# Altium schematic sheet DAC.SchDoc
size A4
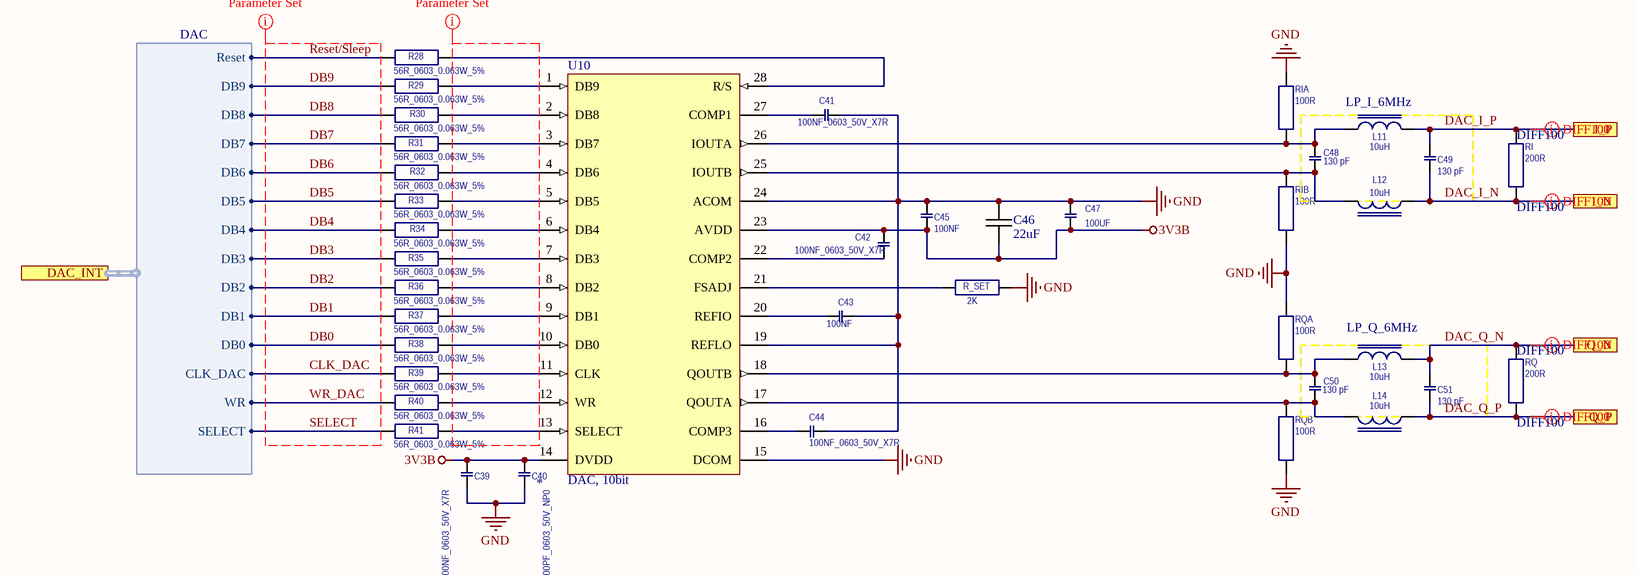
[diagram p0: DAC.SchDoc]

## Parts
C39  100NF_0603_50V_X7R  [CAP0603]
C40  100PF_0603_50V_NP0  [CAP0603]
C41  100NF_0603_50V_X7R  [CAP0603]
C42  100NF_0603_50V_X7R  [CAP0603]
C43  100NF  [CAP0603]
C44  100NF_0603_50V_X7R  [CAP0603]
C45  100NF  [CAP0603]
C46  22uF  [0805C-GENERIC]
C47  100UF  [CAP1210]
C48  130 pF  [CAP0603]
C49  130 pF  [CAP0603]
C50  130 pF  [CAP0603]
C51  130 pF  [CAP0603]
L11  10uH  [L0805]
L12  10uH  [L0805]
L13  10uH  [L0805]
L14  10uH  [L0805]
R28  56R_0603_0.063W_5%  [R0603]
R29  56R_0603_0.063W_5%  [R0603]
R30  56R_0603_0.063W_5%  [R0603]
R31  56R_0603_0.063W_5%  [R0603]
R32  56R_0603_0.063W_5%  [R0603]
R33  56R_0603_0.063W_5%  [R0603]
R34  56R_0603_0.063W_5%  [R0603]
R35  56R_0603_0.063W_5%  [R0603]
R36  56R_0603_0.063W_5%  [R0603]
R37  56R_0603_0.063W_5%  [R0603]
R38  56R_0603_0.063W_5%  [R0603]
R39  56R_0603_0.063W_5%  [R0603]
R40  56R_0603_0.063W_5%  [R0603]
R41  56R_0603_0.063W_5%  [R0603]
R_SET  2K  [R0603]
RI  200R  [R0603]
RIA  100R  [R0603]
RIB  100R  [R0603]
RQ  200R  [R0603]
RQA  100R  [R0603]
RQB  100R  [R0603]
U10  DAC, 10bit  [SSOP28]

## Blocks framed on the sheet
LP_I_6MHz: C48 C49 L11 L12
LP_Q_6MHz: C50 C51 L13 L14

## Ports
DAC_INT (harness DAC), I_N, I_P, Q_N, Q_P

## Harnesses
DAC: DB0, DB1, DB2, DB3, DB4, DB5, DB6, DB7, DB8, DB9, CLK_DAC, WR, SELECT, Reset

## Nets
3V3B: C39.1 C40.1 C42.2 C45.2 C46.2 C47.2 U10.14(DVDD) U10.23(AVDD)
GND: C39.2 C40.2 C41.2 C43.2 C44.1 C45.1 C46.1 C47.1 R_SET.2 RIA.2 RIB.1 RQA.2 RQB.1 U10.15(DCOM) U10.19(REFLO) U10.24(ACOM)
CLK_DAC: R39.1 ; port DAC_INT.CLK_DAC
DAC_I_N: C49.2 L12.1 RI.1 ; port I_N
DAC_I_P: C49.1 L11.2 RI.2 ; port I_P
DAC_Q_N: C51.1 L13.2 RQ.2 ; port Q_N
DAC_Q_P: C51.2 L14.1 RQ.1 ; port Q_P
DB0: R38.1 ; port DAC_INT.DB0
DB1: R37.1 ; port DAC_INT.DB1
DB2: R36.1 ; port DAC_INT.DB2
DB3: R35.1 ; port DAC_INT.DB3
DB4: R34.1 ; port DAC_INT.DB4
DB5: R33.1 ; port DAC_INT.DB5
DB6: R32.1 ; port DAC_INT.DB6
DB7: R31.1 ; port DAC_INT.DB7
DB8: R30.1 ; port DAC_INT.DB8
DB9: R29.1 ; port DAC_INT.DB9
Reset/Sleep: R28.1 ; port DAC_INT.Reset
SELECT: R41.1 ; port DAC_INT.SELECT
WR_DAC: R40.1 ; port DAC_INT.WR
NetC41_1: C41.1 U10.27(COMP1)
NetC42_1: C42.1 U10.22(COMP2)
NetC43_1: C43.1 U10.20(REFIO)
NetC44_2: C44.2 U10.16(COMP3)
NetC48_1: C48.1 L11.1 RIA.1 U10.26(IOUTA)
NetC48_2: C48.2 L12.2 RIB.2 U10.25(IOUTB)
NetC50_1: C50.1 L13.1 RQA.1 U10.18(QOUTB)
NetC50_2: C50.2 L14.2 RQB.2 U10.17(QOUTA)
NetR28_2: R28.2 U10.28(R/S)
NetR29_2: R29.2 U10.1(DB9)
NetR30_2: R30.2 U10.2(DB8)
NetR31_2: R31.2 U10.3(DB7)
NetR32_2: R32.2 U10.4(DB6)
NetR33_2: R33.2 U10.5(DB5)
NetR34_2: R34.2 U10.6(DB4)
NetR35_2: R35.2 U10.7(DB3)
NetR36_2: R36.2 U10.8(DB2)
NetR37_2: R37.2 U10.9(DB1)
NetR38_2: R38.2 U10.10(DB0)
NetR39_2: R39.2 U10.11(CLK)
NetR40_2: R40.2 U10.12(WR)
NetR41_2: R41.2 U10.13(SELECT)
NetR_SET_1: R_SET.1 U10.21(FSADJ)

## Layout directives
net class DAC_BR: CLK_DAC, DB0, DB1, DB2, DB3, DB4, DB5, DB6, DB7, DB8, DB9, Reset/Sleep, SELECT, WR_DAC
net class DAC_AR: (no net found under the mark)
differential pair; net class DIFF100: DAC_I_N, DAC_I_P, DAC_Q_N, DAC_Q_P

## Library data of the parts
C39 C41-C45 C48-C51 = 100NF_0603_50V_X7R: 128-8255    Capacitor MLC-X7R_0603_100NF_10%_50V; C0603C104K5RAC; KEMET; RoHS=Yes
C40 = 100PF_0603_50V_NP0: 141-4603    Capacitor MLC-NPO_0603_100PF_5%_50V; C0603C101J5GAC; KEMET; RoHS=Yes
C46 = 0805C-22UF-6V3-X5R-TDK: CAPACITOR 0805 CERAMIC; Manufacturer: TDK Corporation; Manufacturer Part Number: C2012X5R0J226M; Tolerance: ±20%; Capacitance: 22µF; Temperature Coefficient: X5R; Voltage - Rated: 6.3V; Supplier 1: Digi-Key; Supplier Part Number 1: 445-1422-2-ND; Operating Temperature: -55°C ~ 85°C; Mounting Type: Surface Mount, MLCC; RoHS: RoHS Compliant; Packaging: Tape & Reel (TR); Features: General Purpose; Lead Spacing: -; Category: Capacitors; Thickness: 1.25mm; Package / Case: 0805 (2012 Metric); Supplier Part Number: 445-1422-2-ND; Supplier: Digi-Key
C47 = 100UF_1210_6.3V_X5R: 182-8817    Capacitor CML 100uF_1210_6.3V_X5R_20%; GRM32ER60J107ME20L; MURATA; RoHS=Yes
L11-L14 = BK2125HM601-T: 161-1995    FERRITE CHIP BEAD 500mA, 600Ohm@100MHz; BK2125HM601-T; TAIYO YUDEN; RoHS=Yes
R28-R41 = 0.0R_0603_0.063W_5%: 923-3130    RESISTOR MF_0603_0.0R_0.1W_50V; RC0603JR-070RL; YAGEO; RoHS=Yes
R_SET = 2K2_0603_0.1W_1%: 146-9765    RESISTOR MF_0603_2K2_0.1W_1%_75V; CRCW06032K20FKEA; VISHAY; RoHS=Yes
RI RQ = 100R_0603_0.1W_1%: 146-9752    RESISTOR MF_0603_100R_0.1W_1%_75V; CRCW0603100RFKEA; VISHAY; RoHS=Yes
RIA RIB RQA RQB = 1.0K_0603_0.063W_5%: 923-3385    RESISTOR MF_0603_1.0KR_0.063W_5%_50V; 232270260102; PHYCOMP; RoHS=Yes
U10 = AD9761: Parameter 1: *